# EAGLE schematic main (EAGLE 5.11)
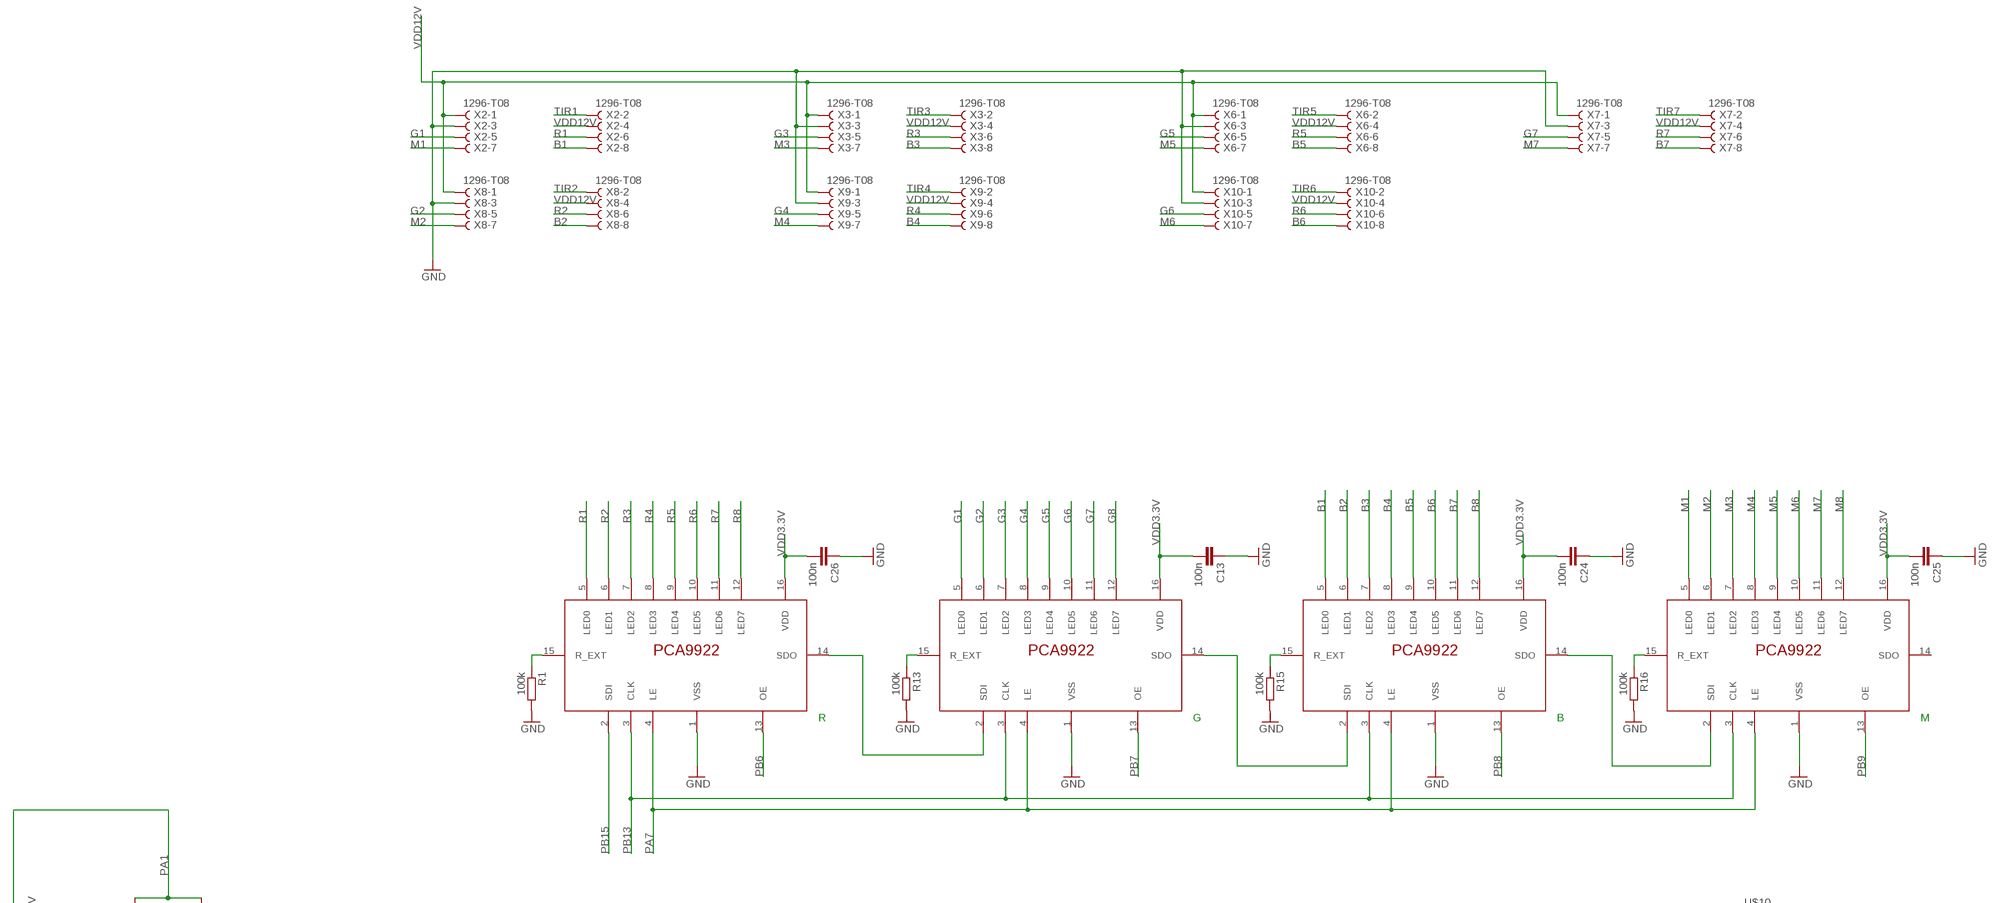
[diagram p0: schematic, sheet 1, part 1 of 3]
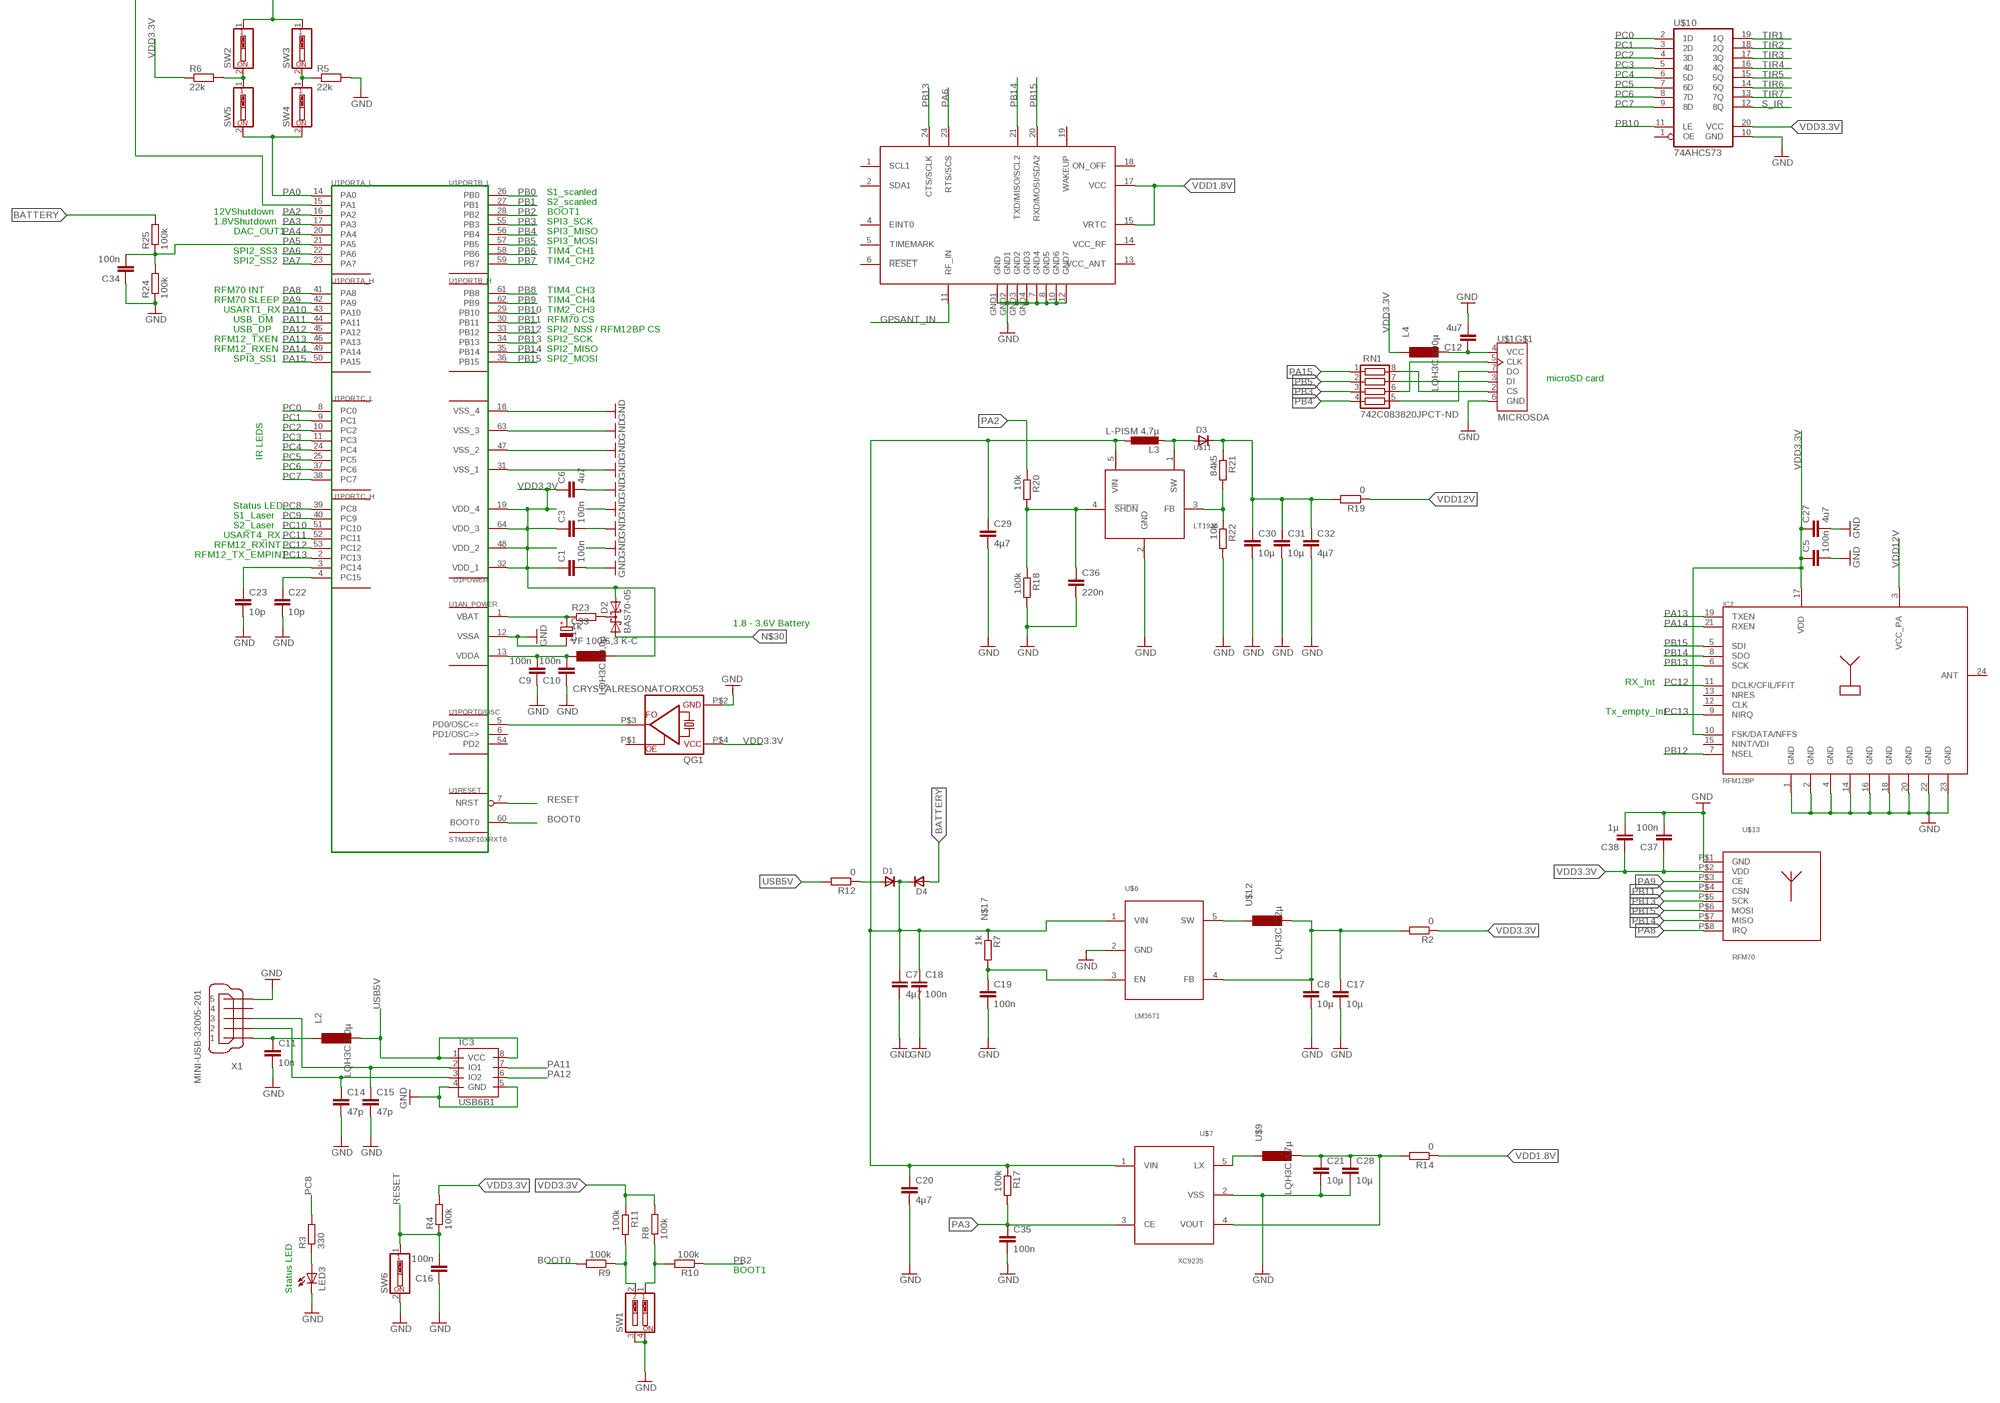
[diagram p1: schematic, sheet 1, part 2 of 3]
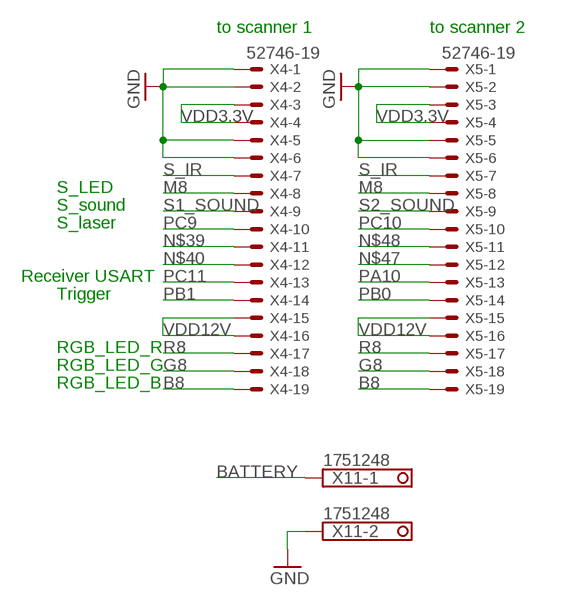
[diagram p2: schematic, sheet 1, part 3 of 3]

## Parts
C1  100n  C-EUC0603  [C0603]
C3  100n  C-EUC0805  [C0805]
C5  100n  C-EUC0805  [C0805]
C6  4u7  C-EUC1206  [C1206]
C7  4µ7  C-EUC0805  [C0805]
C8  10µ  C-EUC0805  [C0805]
C9  100n  C-EUC0603  [C0603]
C10  100n  C-EUC0603  [C0603]
C11  10n  C-EUC0805  [C0805]
C12  4u7  C-EUC0805  [C0805]
C13  100n  C-EUC0805  [C0805]
C14  47p  C-EUC0805  [C0805]
C15  47p  C-EUC0805  [C0805]
C16  100n  C-EUC0805  [C0805]
C17  10µ  C-EUC0805  [C0805]
C18  100n  C-EUC0805  [C0805]
C19  100n  C-EUC0805  [C0805]
C20  4µ7  C-EUC0805  [C0805]
C21  10µ  C-EUC0805  [C0805]
C22  10p  C-EUC0805  [C0805]
C23  10p  C-EUC0805  [C0805]
C24  100n  C-EUC0805  [C0805]
C25  100n  C-EUC0805  [C0805]
C26  100n  C-EUC0805  [C0805]
C27  4u7  C-EUC0805  [C0805]
C28  10µ  C-EUC0805  [C0805]
C29  4µ7  C-EUC0805  [C0805]
C30  10µ  C-EUC0805  [C0805]
C31  10µ  C-EUC0805  [C0805]
C32  4µ7  C-EUC0805  [C0805]
C33  VF 100/6,3 K-C  CPOL-EUC  [PANASONIC_C]
C34  100n  C-EUC0805  [C0805]
C35  100n  C-EUC0805  [C0805]
C36  220n  C-EUC0805  [C0805]
C37  100n  C-EUC0805  [C0805]
C38  1µ  C-EUC0805  [C0805]
D1  DSMA  [DSMA]
D2  BAS70-05  [SOT23]
D3  DSMA  [DSMA]
D4  DSMA  [DSMA]
IC2  RFM12BP  [RFM_BP]
IC3  USB6B1  [SO08]
L1  LQH3C 10,0µ  L1210  [L1210]
L2  LQH3C 1,0µ  L1210  [L1210]
L3  L-PISM 4,7µ  L-EUPISM  [PISM]
L4  LQH3C 100µ  L1210  [L1210]
LED3  LEDCHIPLED_1206  [CHIPLED_1206]
QG1  CRYSTALRESONATORXO53  [XO53]
R1  100k  R-EU_R0805  [R0805]
R2  0  R-EU_R0805  [R0805]
R3  330  R-EU_R0805  [R0805]
R4  100k  R-EU_R0805  [R0805]
R5  22k  R-EU_R0805  [R0805]
R6  22k  R-EU_R0805  [R0805]
R7  1k  R-EU_R0805  [R0805]
R8  100k  R-EU_R0805  [R0805]
R9  100k  R-EU_R0805  [R0805]
R10  100k  R-EU_R0805  [R0805]
R11  100k  R-EU_R0805  [R0805]
R12  0  R-EU_R0805  [R0805]
R13  100k  R-EU_R0805  [R0805]
R14  0  R-EU_R0805  [R0805]
R15  100k  R-EU_R0805  [R0805]
R16  100k  R-EU_R0805  [R0805]
R17  100k  R-EU_R0805  [R0805]
R18  100k  R-EU_R0805  [R0805]
R19  0  R-EU_R0805  [R0805]
R20  10k  R-EU_R0805  [R0805]
R21  84k5  R-EU_R0805  [R0805]
R22  10k  R-EU_R0805  [R0805]
R23  1k  R-EU_R0805  [R0805]
R24  100k  R-EU_R0805  [R0805]
R25  100k  R-EU_R0805  [R0805]
RN1  742C083820JPCT-ND  CTS742C083  [CTS742C083]
SW1  SW_DIP-2  [EDG-02]
SW2  SW_DIP-1  [EDG-01]
SW3  SW_DIP-1  [EDG-01]
SW4  SW_DIP-1  [EDG-01]
SW5  SW_DIP-1  [EDG-01]
SW6  SW_DIP-1  [EDG-01]
U1  STM32F10XRXT6  [TQFP64]
U$1  MICROSDA  [ALPS_MICROSD]
U$2  PCA9922  [TSSOP16]
U$3  PCA9922  [TSSOP16]
U$4  PCA9922  [TSSOP16]
U$5  PCA9922  [TSSOP16]
U$6  LM3671  [SOT23-5L]
U$7  XC9235  [SOT23-5L]
U$8  SIM18  [SIM18]
U$9  LQH3C 4,7µ  L1210  [L1210]
U$10  74AHC573  [TSSOP20]
U$11  LT1935  [TSOT23-5]
U$12  LQH3C 2,2µ  L1210  [L1210]
U$13  RFM70  [RFM70]
X1  MINI-USB-32005-201  [32005-201]
X2  1296-T08  [1296-08]
X3  1296-T08  [1296-08]
X4  52746-19  [52746-19]
X5  52746-19  [52746-19]
X6  1296-T08  [1296-08]
X7  1296-T08  [1296-08]
X8  1296-T08  [1296-08]
X9  1296-T08  [1296-08]
X10  1296-T08  [1296-08]
X11  1751248  [1751248]

## Nets
B1: U$4.5(LED0) X2.8
B2: U$4.6(LED1) X8.8
B3: U$4.7(LED2) X3.8
B4: U$4.8(LED3) X9.8
B5: U$4.9(LED4) X6.8
B6: U$4.10(LED5) X10.8
B7: U$4.11(LED6) X7.8
B8: U$4.12(LED7) X4.19 X5.19
BATTERY: D4.A R25.2 X11.1
BOOT0: R9.2 U1.60(RESET:BOOT0)
G1: U$3.5(LED0) X2.5
G2: U$3.6(LED1) X8.5
G3: U$3.7(LED2) X3.5
G4: U$3.8(LED3) X9.5
G5: U$3.9(LED4) X6.5
G6: U$3.10(LED5) X10.5
G7: U$3.11(LED6) X7.5
G8: U$3.12(LED7) X4.18 X5.18
GND: C1.2 C3.2 C5.2 C6.2 C7.2 C8.2 C9.1 C10.1 C11.2 C12.2 C13.1 C14.2 C15.2 C16.1 C17.2 C18.2 C19.2 C20.2 C21.2 C22.2 C23.2 C24.1 C25.1 C26.1 C27.2 C28.2 C29.2 C30.2 C31.2 C32.2 C33.- C34.1 C35.2 C36.2 C37.2 C38.2 IC2.1(GND) IC2.2(GND) IC2.4(GND) IC2.14(GND) IC2.16(GND) IC2.18(GND) IC2.20(GND) IC2.22(GND) IC2.23(GND) IC3.4(GND) IC3.5(GND) LED3.C QG1.P$2(GND) R1.2 R5.2 R13.2 R15.2 R16.2 R18.2 R22.2 R24.1 SW1.3 SW1.4 SW6.2 U1.12(AN_POWER:VSSA) U1.18(POWER:VSS_4) U1.31(POWER:VSS_1) U1.47(POWER:VSS_2) U1.63(POWER:VSS_3) U$1.6(GND) U$2.1(VSS) U$3.1(VSS) U$4.1(VSS) U$5.1(VSS) U$6.2(GND) U$7.2(VSS) U$8.7(GND4) U$8.8(GND5) U$8.10(GND6) U$8.12(GND7) U$8.GND1(GND) U$8.GND2(GND1) U$8.GND3(GND2) U$8.GND4(GND3) U$10.10(GND) U$11.2(GND) U$13.P$1(GND) X1.5 X2.3 X3.3 X4.1 X4.2 X4.5 X4.6 X5.1 X5.2 X5.5 X5.6 X6.3 X7.3 X8.3 X9.3 X10.3 X11.2
GPSANT_IN: U$8.11(RF_IN)
M1: U$5.5(LED0) X2.7
M2: U$5.6(LED1) X8.7
M3: U$5.7(LED2) X3.7
M4: U$5.8(LED3) X9.7
M5: U$5.9(LED4) X6.7
M6: U$5.10(LED5) X10.7
M7: U$5.11(LED6) X7.7
M8: U$5.12(LED7) X4.8 X5.8
N$2: C9.2 C10.2 L1.2 U1.13(AN_POWER:VDDA)
N$3: D2.3(C) R23.2
N$4: C12.1 L4.1 U$1.4(VCC)
N$5: RN1.8 U$1.2(CS)
N$6: C11.1 L2.2 X1.1
N$7: C22.1 U1.4(PORTC_H:PC15)
N$8: C14.1 IC3.3(IO2) X1.2
N$9: C15.1 IC3.2(IO1) X1.3
N$10: LED3.A R3.1
N$11: RN1.7 U$1.3(DI)
N$12: C23.1 U1.3(PORTC_H:PC14)
N$13: U$2.14(SDO) U$3.2(SDI)
N$14: U$3.14(SDO) U$4.2(SDI)
N$15: U$4.14(SDO) U$5.2(SDI)
N$16: C7.1 C18.1 C20.1 C29.1 D1.C D4.C L3.1 R7.1 R17.1 U$6.1(VIN) U$7.1(VIN) U$11.5(VIN)
N$17: C19.1 R7.2 U$6.3(EN)
N$18: C8.1 C17.1 R2.2 U$6.4(FB) U$12.1
N$19: QG1.P$3(FO) U1.5(PORTD/OSC:PD0/OSC<=)
N$20: U$7.5(LX) U$9.2
N$21: C21.1 C28.1 R14.2 U$7.4(VOUT) U$9.1
N$22: U$6.5(SW) U$12.2
N$23: R8.1 R10.2 SW1.1
N$24: R9.1 R11.2 SW1.2
N$25: R1.1 U$2.15(R_EXT)
N$26: R13.1 U$3.15(R_EXT)
N$27: R15.1 U$4.15(R_EXT)
N$28: R16.1 U$5.15(R_EXT)
N$29: C36.1 R18.1 R20.2 U$11.4(!SHDN)
N$30: D2.1(A1)
N$31: C33.+ R23.1 U1.1(AN_POWER:VBAT)
N$32: R6.2 SW2.2 SW5.1
N$33: C30.1 C31.1 C32.1 D3.C R19.2 R21.1
N$34: R5.1 SW3.2 SW4.1
N$35: R21.2 R22.1 U$11.3(FB)
N$36: D3.A L3.2 U$11.1(SW)
N$37: RN1.5 U$1.7(DO)
N$38: RN1.6 U$1.5(CLK)
N$39: X4.11
N$40: X4.12
N$47: X5.12
N$48: X5.11
N$72: D1.A R12.1
PA0: SW4.2 SW5.2 U1.14(PORTA_L:PA0)
PA1: SW2.1 SW3.1 U1.15(PORTA_L:PA1)
PA2: R20.1 U1.16(PORTA_L:PA2)
PA3: C35.1 R17.2 U1.17(PORTA_L:PA3) U$7.3(CE)
PA4: U1.20(PORTA_L:PA4)
PA5: C34.2 R24.2 R25.1 U1.21(PORTA_L:PA5)
PA6: U1.22(PORTA_L:PA6) U$8.23(RTS/SCS)
PA7: U1.23(PORTA_L:PA7) U$2.4(LE) U$3.4(LE) U$4.4(LE) U$5.4(LE)
PA8: U1.41(PORTA_H:PA8) U$13.P$8(IRQ)
PA9: U1.42(PORTA_H:PA9) U$13.P$3(CE)
PA10: U1.43(PORTA_H:PA10) X5.13
PA11: IC3.7(IO1) U1.44(PORTA_H:PA11)
PA12: IC3.6(IO2) U1.45(PORTA_H:PA12)
PA13: IC2.19(TXEN) U1.46(PORTA_H:PA13)
PA14: IC2.21(RXEN) U1.49(PORTA_H:PA14)
PA15: RN1.1 U1.50(PORTA_H:PA15)
PB0: U1.26(PORTB_L:PB0) X5.14
PB1: U1.27(PORTB_L:PB1) X4.14
PB2: R10.1 U1.28(PORTB_L:PB2)
PB3: RN1.3 U1.55(PORTB_L:PB3)
PB4: RN1.4 U1.56(PORTB_L:PB4)
PB5: RN1.2 U1.57(PORTB_L:PB5)
PB6: U1.58(PORTB_L:PB6) U$2.13(OE)
PB7: U1.59(PORTB_L:PB7) U$3.13(OE)
PB8: U1.61(PORTB_H:PB8) U$4.13(OE)
PB9: U1.62(PORTB_H:PB9) U$5.13(OE)
PB10: U1.29(PORTB_H:PB10) U$10.11(LE)
PB11: U1.30(PORTB_H:PB11) U$13.P$4(CSN)
PB12: IC2.7(NSEL) U1.33(PORTB_H:PB12)
PB13: IC2.6(SCK) U1.34(PORTB_H:PB13) U$2.3(CLK) U$3.3(CLK) U$4.3(CLK) U$5.3(CLK) U$8.24(CTS/SCLK) U$13.P$5(SCK)
PB14: IC2.8(SDO) U1.35(PORTB_H:PB14) U$8.21(TXD/MISO/SCL2) U$13.P$7(MISO)
PB15: IC2.5(SDI) U1.36(PORTB_H:PB15) U$2.2(SDI) U$8.20(RXD/MOSI/SDA2) U$13.P$6(MOSI)
PC0: U1.8(PORTC_L:PC0) U$10.2(1D)
PC1: U1.9(PORTC_L:PC1) U$10.3(2D)
PC2: U1.10(PORTC_L:PC2) U$10.4(3D)
PC3: U1.11(PORTC_L:PC3) U$10.5(4D)
PC4: U1.24(PORTC_L:PC4) U$10.6(5D)
PC5: U1.25(PORTC_L:PC5) U$10.7(6D)
PC6: U1.37(PORTC_L:PC6) U$10.8(7D)
PC7: U1.38(PORTC_L:PC7) U$10.9(8D)
PC8: R3.2 U1.39(PORTC_H:PC8)
PC9: U1.40(PORTC_H:PC9) X4.10
PC10: U1.51(PORTC_H:PC10) X5.10
PC11: U1.52(PORTC_H:PC11) X4.13
PC12: IC2.11(DCLK/CFIL/FFIT) U1.53(PORTC_H:PC12)
PC13: IC2.9(NIRQ) U1.2(PORTC_H:PC13)
R1: U$2.5(LED0) X2.6
R2: U$2.6(LED1) X8.6
R3: U$2.7(LED2) X3.6
R4: U$2.8(LED3) X9.6
R5: U$2.9(LED4) X6.6
R6: U$2.10(LED5) X10.6
R7: U$2.11(LED6) X7.6
R8: U$2.12(LED7) X4.17 X5.17
RESET: C16.2 R4.1 SW6.1 U1.7(RESET:NRST)
S1_SOUND: X4.9
S2_SOUND: X5.9
S_IR: U$10.12(8Q) X4.7 X5.7
TIR1: U$10.19(1Q) X2.2
TIR2: U$10.18(2Q) X8.2
TIR3: U$10.17(3Q) X3.2
TIR4: U$10.16(4Q) X9.2
TIR5: U$10.15(5Q) X6.2
TIR6: U$10.14(6Q) X10.2
TIR7: U$10.13(7Q) X7.2
USB5V: IC3.1(VCC) IC3.8(VCC) L2.1 R12.2
VDD1.8V: R14.1 U$8.15(VRTC) U$8.17(VCC)
VDD3.3V: C1.1 C3.1 C5.1 C6.1 C13.2 C24.2 C25.2 C26.2 C27.1 C37.1 C38.1 D2.2(A2) IC2.10(FSK/DATA/NFFS) IC2.17(VDD) L1.1 L4.2 QG1.P$4(VCC) R2.1 R4.2 R6.1 R8.2 R11.1 U1.19(POWER:VDD_4) U1.32(POWER:VDD_1) U1.48(POWER:VDD_2) U1.64(POWER:VDD_3) U$2.16(VDD) U$3.16(VDD) U$4.16(VDD) U$5.16(VDD) U$10.20(VCC) U$13.P$2(VDD) X4.3 X4.4 X5.3 X5.4
VDD12V: IC2.3(VCC_PA) R19.1 X2.1 X2.4 X3.1 X3.4 X4.15 X4.16 X5.15 X5.16 X6.1 X6.4 X7.1 X7.4 X8.1 X8.4 X9.1 X9.4 X10.1 X10.4
Unconnected: IC2.12(CLK) IC2.13(NRES) IC2.15(NINT/VDI) IC2.24(ANT) QG1.P$1(OE) U1.6(PORTD/OSC:PD1/OSC=>) U1.54(PORTD/OSC:PD2) U$1.SW1(P) U$1.SW2(S) U$5.14(SDO) U$8.1(SCL1) U$8.2(SDA1) U$8.4(EINT0) U$8.5(TIMEMARK) U$8.6(!RESET) U$8.13(VCC_ANT) U$8.14(VCC_RF) U$8.18(ON_OFF) U$8.19(WAKEUP) U$10.1(OE) X1.4

## Notes on the sheet
- R | G | B | M
- to scanner 1 | to scanner 2
- S_LED
- S_sound
- S_laser
- S1_scanled
- S2_scanled
- 12VShutdown | BOOT1 | Receiver USART
- 1.8VShutdown | SPI3_SCK | Trigger
- DAC_OUT1 | SPI3_MISO
- SPI3_MOSI
- SPI2_SS3 | TIM4_CH1 | RGB_LED_R
- SPI2_SS2 | TIM4_CH2 | RGB_LED_G
- RGB_LED_B
- RFM70 INT | TIM4_CH3
- RFM70 SLEEP | TIM4_CH4
- USART1_RX | TIM2_CH3
- USB_DM | RFM70 CS
- USB_DP | SPI2_NSS / RFM12BP CS
- RFM12_TXEN | SPI2_SCK
- RFM12_RXEN | SPI2_MISO
- SPI3_SS1 | SPI2_MOSI
- microSD card
- IR LEDS
- Status LED
- S1_Laser
- S2_Laser
- USART4_RX
- RFM12_RXINT
- RFM12_TX_EMPINT
- 1.8 - 3.6V Battery
- RX_Int
- Tx_empty_Int
- BOOT1
- Status LED

## Library data of the parts
C1 C3 C5-C32 C34-C38 = rcl:C-EU: CAPACITOR, European symbol
C33 = rcl:CPOL-EU: POLARIZED CAPACITOR, European symbol
D1 D3 D4 = diodes:D: Diode
D2 = diode:BAS70-05: Silicon Schottky Diodes General-purpose diode for high-speed switching
IC2 = hopeRF:RFM12BP
IC3 = st-microelectronics:USB6B1: DATA LINES PROTECTION Source: http://www.st.com/stonline/products/literature/ds/5605.pdf; MPN: USB6B1; OC_FARNELL: 9804358; OC_NEWARK: 26M4750
L1 L2 L4 U$9 U$12 = Labor:L1210
L3 = Inductor-Fastron:L-EU
LED3 = led:LED: LED OSRAM: - CHIPLED LG R971, LG N971, LY N971, LG Q971, LY Q971, LO R971, LY R971 LH N974, LH R974 LS Q976, LO Q976, LY Q976 LO Q996 - Hyper CHIPLED LW Q18S LB Q993, LB Q99A, LB R99A - SideLED LS A670, LO A670, LY A670, LG A670, LP A670 LB A673, LV A673, LT A673, LW A673 LH A674 LY A675 LS A676, LA A676, LO A676, LY A676, LW A676 LS A679, LY A679, LG A679 - Hyper Micro SIDELED® LS Y876, LA Y876, LO Y876, LY Y876 LT Y87S - SmartLED LW L88C, LW L88S LB L89C, LB L89S, LG L890 LS L89K, LO L89K, LY L89K LS L896, LA L896, LO L896, LY L896 - TOPLED LS T670, LO T670, LY T670, LG T670, LP T670 LSG T670, LSP T670, LSY T670, LOP T670, LYG T670 LG T671, LOG T671, LSG T671 LB T673, LV T673, LT T673, LW T673 LH T674 LS T676, LA T676, LO T676, LY T676, LB T676, LH T676, LSB T676, LW T676 LB T67C, LV T67C, LT T67C, LS T67K, LO T67K, LY T67K, LW E67C LS E67B, LA E67B, LO E67B, LY E67B, LB E67C, LV E67C, LT E67C LW T67C LS T679, LY T679, LG T679 LS T770, LO T770, LY T770, LG T770, LP T770 LB T773, LV T773, LT T773, LW T773 LH T774 LS E675, LA E675, LY E675, LS T675 LS T776, LA T776, LO T776, LY T776, LB T776 LHGB T686 LT T68C, LB T68C - Hyper Mini TOPLED® LB M676 - Mini TOPLED Santana® LG M470 LS M47K, LO M47K, LY M47K Source: http://www.osram.convergy.de LUXEON: - LUMILED® LXK2-PW12-R00, LXK2-PW12-S00, LXK2-PW14-U00, LXK2-PW14-V00 LXK2-PM12-R00, LXK2-PM12-S00, LXK2-PM14-U00 LXK2-PE12-Q00, LXK2-PE12-R00, LXK2-PE12-S00, LXK2-PE14-T00, LXK2-PE14-U00 LXK2-PB12-K00, LXK2-PB12-L00, LXK2-PB12-M00, LXK2-PB14-N00, LXK2-PB14-P00, LXK2-PB14-Q00 LXK2-PR12-L00, LXK2-PR12-M00, LXK2-PR14-Q00, LXK2-PR14-R00 LXK2-PD12-Q00, LXK2-PD12-R00, LXK2-PD12-S00 LXK2-PH12-R00, LXK2-PH12-S00 LXK2-PL12-P00, LXK2-PL12-Q00, LXK2-PL12-R00 Source: www.luxeon.com KINGBRIGHT: KA-3528ASYC Source: www.kingbright.com
QG1 = Crystals-new:CRYSTALRESONATOR
R1-R25 = rcl:R-EU_: RESISTOR, European symbol
RN1 = resistor-net:CTS742C083: Chip Resistor Array 4 Single Resistor Source: http://www.ctscorp.com/components/Datasheets/CTSChipArrayDs.pdf; OC_FARNELL: unknown; OC_NEWARK: unknown
SW1 = special:SW_DIP-2: DIP SWITCH
SW2-SW6 = special:SW_DIP-1: DIP SWITCH
U1 = stm32:STM32F10XRXT6: STM32F101/103 64pin LQFP
U$1 = card_adapters:MICROSD: microSD card holder, with card detect switch
U$2-U$5 = nxp:PCA9922: The PCA9922 is an 8-channel constant current LED driver designed for LED signage and display applications. The output current is adjustable from 15 mA to 60 mA controlled by an external series resistor. The outputs are controlled via a serial interface with a maximum clock frequency of 25 MHz to allow for the system requirement of high volume data transmission. Each of the 8 channel outputs has edge rate control to limit the change in current when the outputs are enabled or disabled
U$6 = Labor:LM3671: LM3671 2MHz, 600mA Step-Down DC-DC Converter
U$7 = Labor:XC9235: 600mA Driver Tr. Built-In, Synchronous Step-Down DC/DC Converters
U$8 = Labor:SIM18: SIMCom presents an ultra compact and reliable GPS module-SIM18. This is a standalone L1 frequency GPS module in a SMT type and it is designed with SiRF4 high sensitivity navigation engine, which allows you to benefit from small dimensions and cost-effective solutions.
U$10 = Labor:74AHC573
U$11 = Labor:LT1935: 1.2MHz Boost DC/DC Converter in ThinSOT with 2A Switch
U$13 = Labor:RFM70
X1 = con-cypressindustries:MINI-USB-: MINI USB-B Conector Source: www.cypressindustries.com; OC_FARNELL: unknown; OC_NEWARK: unknown
X2 X3 X6-X10 = con-leotronics:1296-T08: 1.27mm SINGLE ROW FEMALE SOCKET Source: http://www.leotronics.co.uk/Conexcon/Data%20Sheets/sec.%20A/1296ing.pdf; OC_FARNELL: unknown; OC_NEWARK: unknown
X4 X5 = con-molex:52746-19: FPC Connector ZIF for SMT 0.5mm Source: http://www.farnell.com/datasheets/73044.pdf [DWG. NO. (Sheet 1 OF 2) SD-52746-**17]; MPN: 52746-1970; OC_FARNELL: unknown; OC_NEWARK: 92M6422
X11 = con-phoenix-350:1751248: MKDS 1/ 2-3,5 Printklemme Nennstrom: 10 A Bemessungsspannung: 160 V Raster: 3,5 mm Polzahl: 2 Montageart: Löten Anschlussart: Schraubanschluss Anschlussrichtung vom Leiter zur Platine: 0° Source: http://eshop.phoenixcontact.com .. 1751248.pdf; OC_FARNELL: unknown; OC_NEWARK: unknown